# EAGLE design weather baloon_RX (EAGLE 9.2.0)
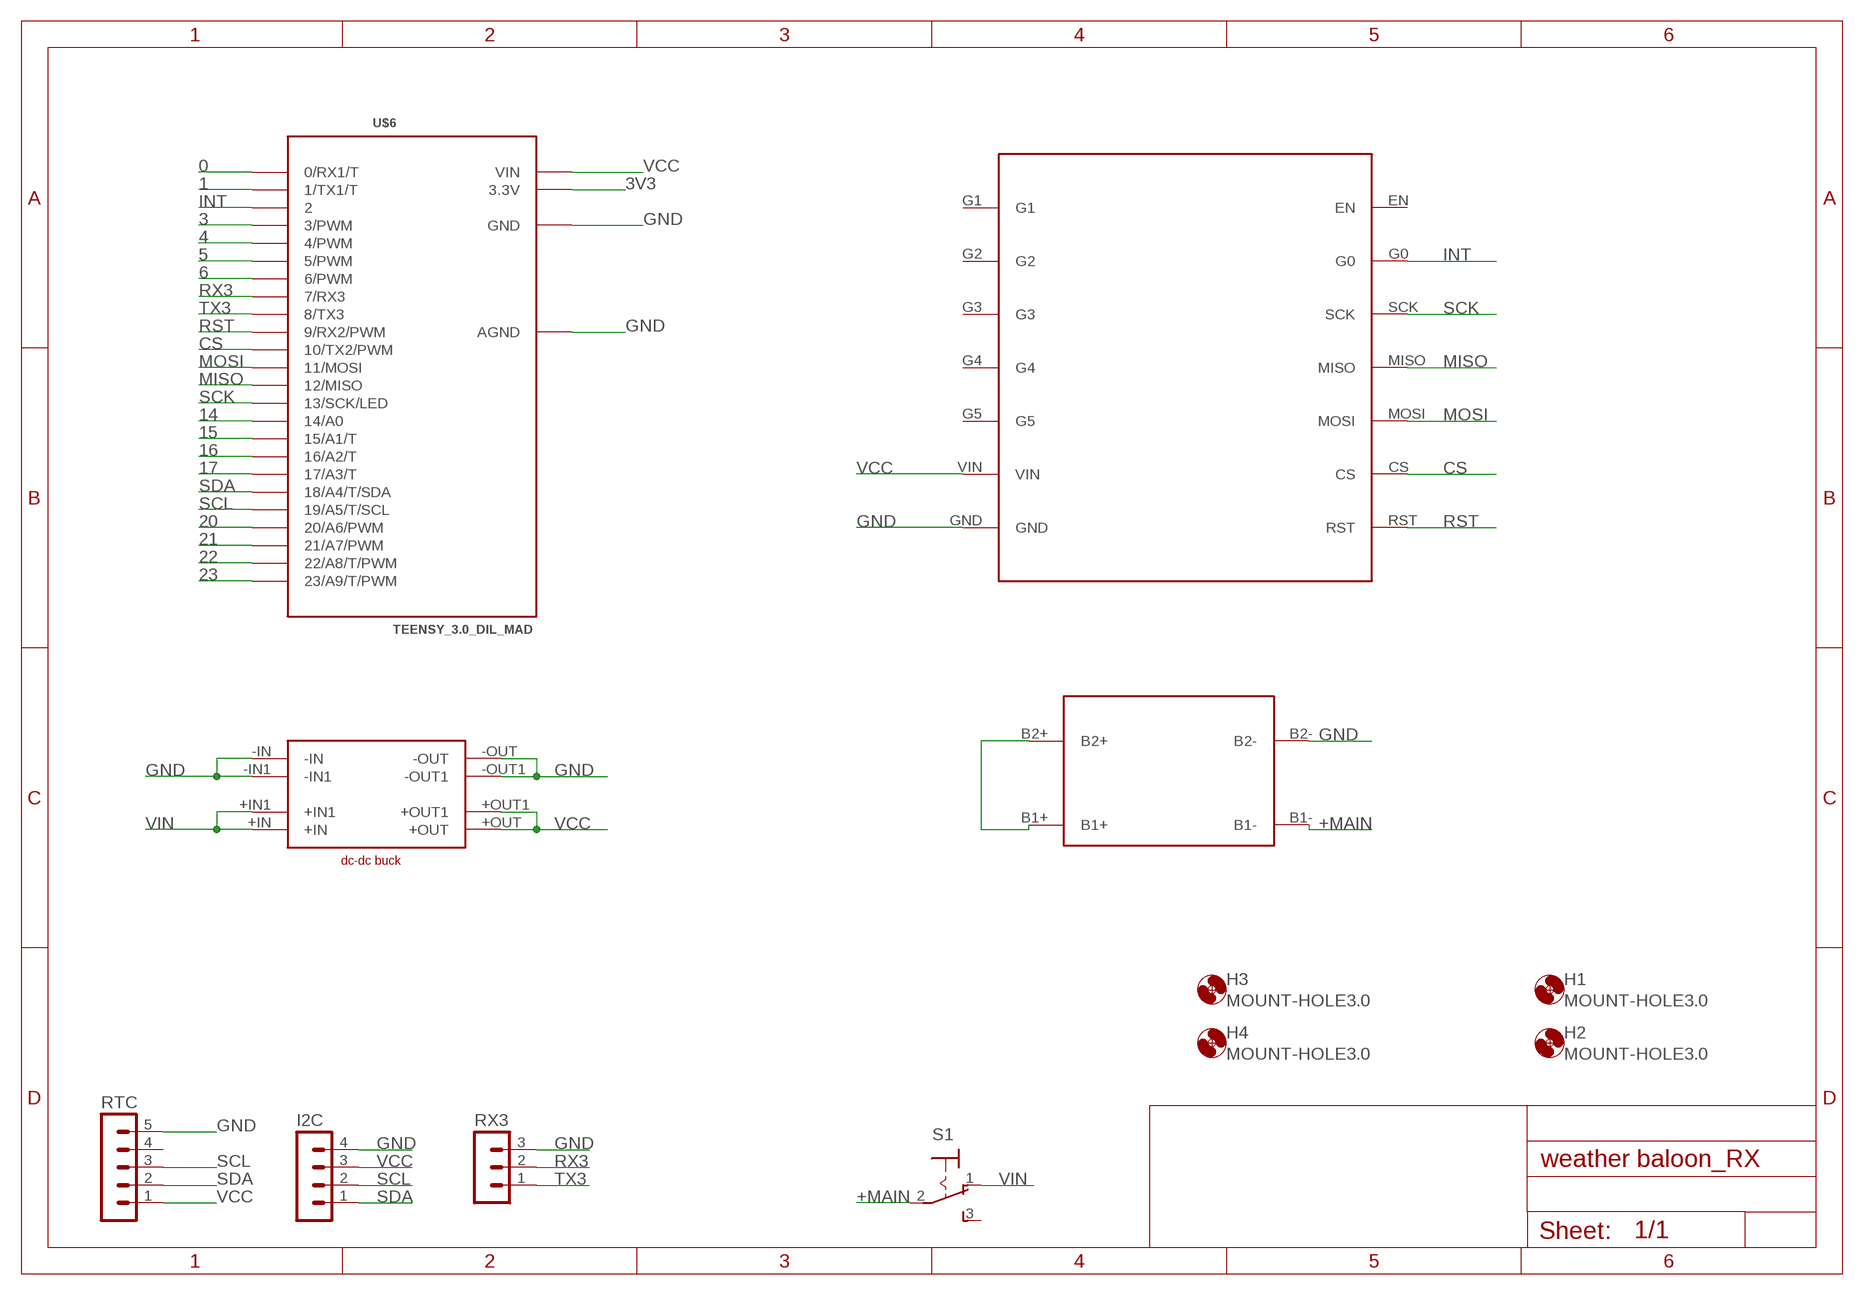
[diagram p0: schematic, sheet 1]

## Parts
H1  MOUNT-HOLE3.0  [3,0]
H2  MOUNT-HOLE3.0  [3,0]
H3  MOUNT-HOLE3.0  [3,0]
H4  MOUNT-HOLE3.0  [3,0]
I2C  MA04-1  [MA04-1]
RTC  MA05-1  [MA05-1]
RX3  MA03-1  [MA03-1]
S1  320-916  [320-916]
U$2  RFM96_MAD  [RFM96]
U$3  DC-DC_BUCK_MAD  [DC-DC_BUCK]
U$4  18650-2  [18650-2]
U$6  TEENSY_3.0_DIL_MAD  [TEENSY_3.0_DIL_MAD]

## Nets
0: U$6.0(0/RX1/T)
1: U$6.1(1/TX1/T)
3: U$6.3(3/PWM)
3V3: U$6.3.3V
4: U$6.4(4/PWM)
5: U$6.5(5/PWM)
6: U$6.6(6/PWM)
14: U$6.14/A0
15: U$6.15/A1(15/A1/T)
16: U$6.16/A2(16/A2/T)
17: U$6.17/A3(17/A3/T)
20: U$6.20/A6(20/A6/PWM)
21: U$6.21/A7(21/A7/PWM)
22: U$6.22/A8(22/A8/T/PWM)
23: U$6.23/A9(23/A9/T/PWM)
+MAIN: S1.2(P) U$4.B1-
CS: U$2.CS U$6.10(10/TX2/PWM)
GND: I2C.4 RTC.5 RX3.3 U$2.GND U$3.-IN U$3.-IN1 U$3.-OUT U$3.-OUT1 U$4.B2- U$6.AGND U$6.GND
INT: U$2.G0 U$6.2
MISO: U$2.MISO U$6.12(12/MISO)
MOSI: U$2.MOSI U$6.11(11/MOSI)
N$1: U$4.B1+ U$4.B2+
RST: U$2.RST U$6.9(9/RX2/PWM)
RX3: RX3.2 U$6.7(7/RX3)
SCK: U$2.SCK U$6.13(13/SCK/LED)
SCL: I2C.2 RTC.3 U$6.19/A5(19/A5/T/SCL)
SDA: I2C.1 RTC.2 U$6.18/A4(18/A4/T/SDA)
TX3: RX3.1 U$6.8(8/TX3)
VCC: I2C.3 RTC.1 U$2.VIN U$3.+OUT U$3.+OUT1 U$6.VIN
VIN: S1.1(O) U$3.+IN U$3.+IN1
Unconnected: RTC.4 S1.3(S) U$2.EN U$2.G1 U$2.G2 U$2.G3 U$2.G4 U$2.G5

## Library data of the parts
H1-H4 = holes:MOUNT-HOLE: MOUNTING HOLE with drill center marker
I2C = con-lstb:MA04-1: PIN HEADER; OC_FARNELL: unknown; OC_NEWARK: unknown
RTC = con-lstb:MA05-1: PIN HEADER; OC_FARNELL: unknown; OC_NEWARK: unknown
RX3 = con-lstb:MA03-1: PIN HEADER; OC_FARNELL: unknown; OC_NEWARK: unknown
S1 = switch:320-916: TOGGLE SWITCH distributor RS Components
U$2 = rfm95_mad:RFM96_MAD: rfm96_mad
U$3 = dc-dc_mad:DC-DC_BUCK_MAD
U$4 = 18650 holder-3:18650-2
U$6 = Teensy_3_and_LC_Series_Boards_v1.4:TEENSY_3.0_DIL_MAD

## Board
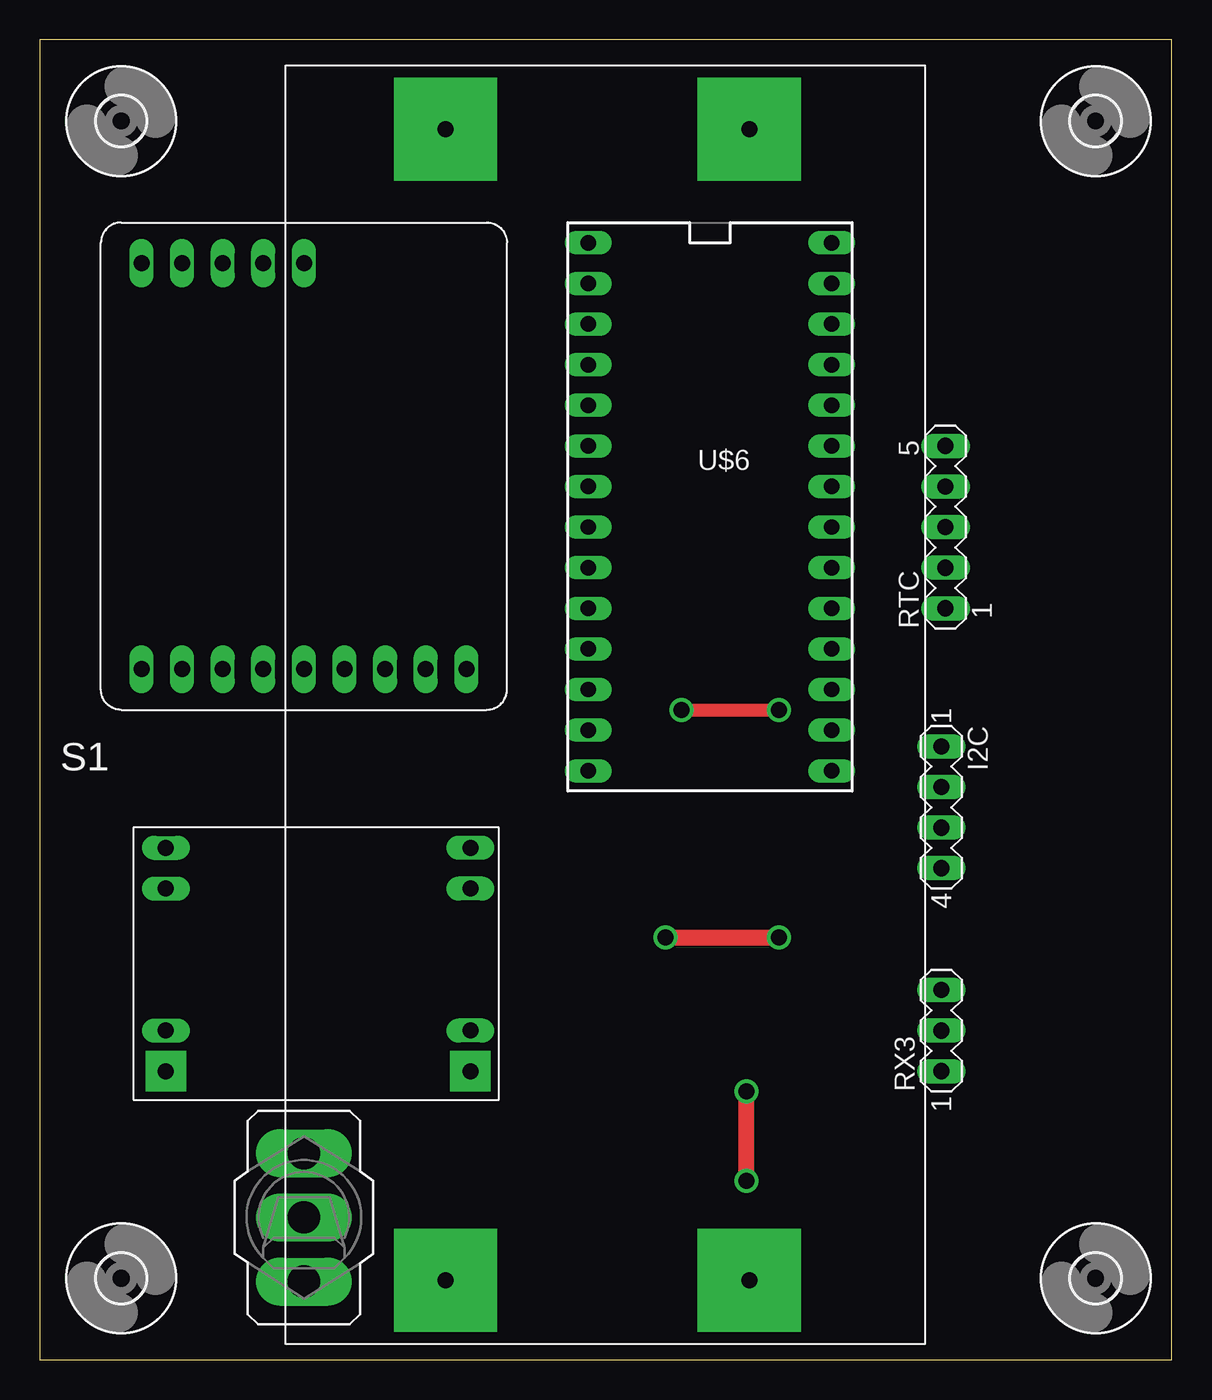
[diagram p1: board, top side]
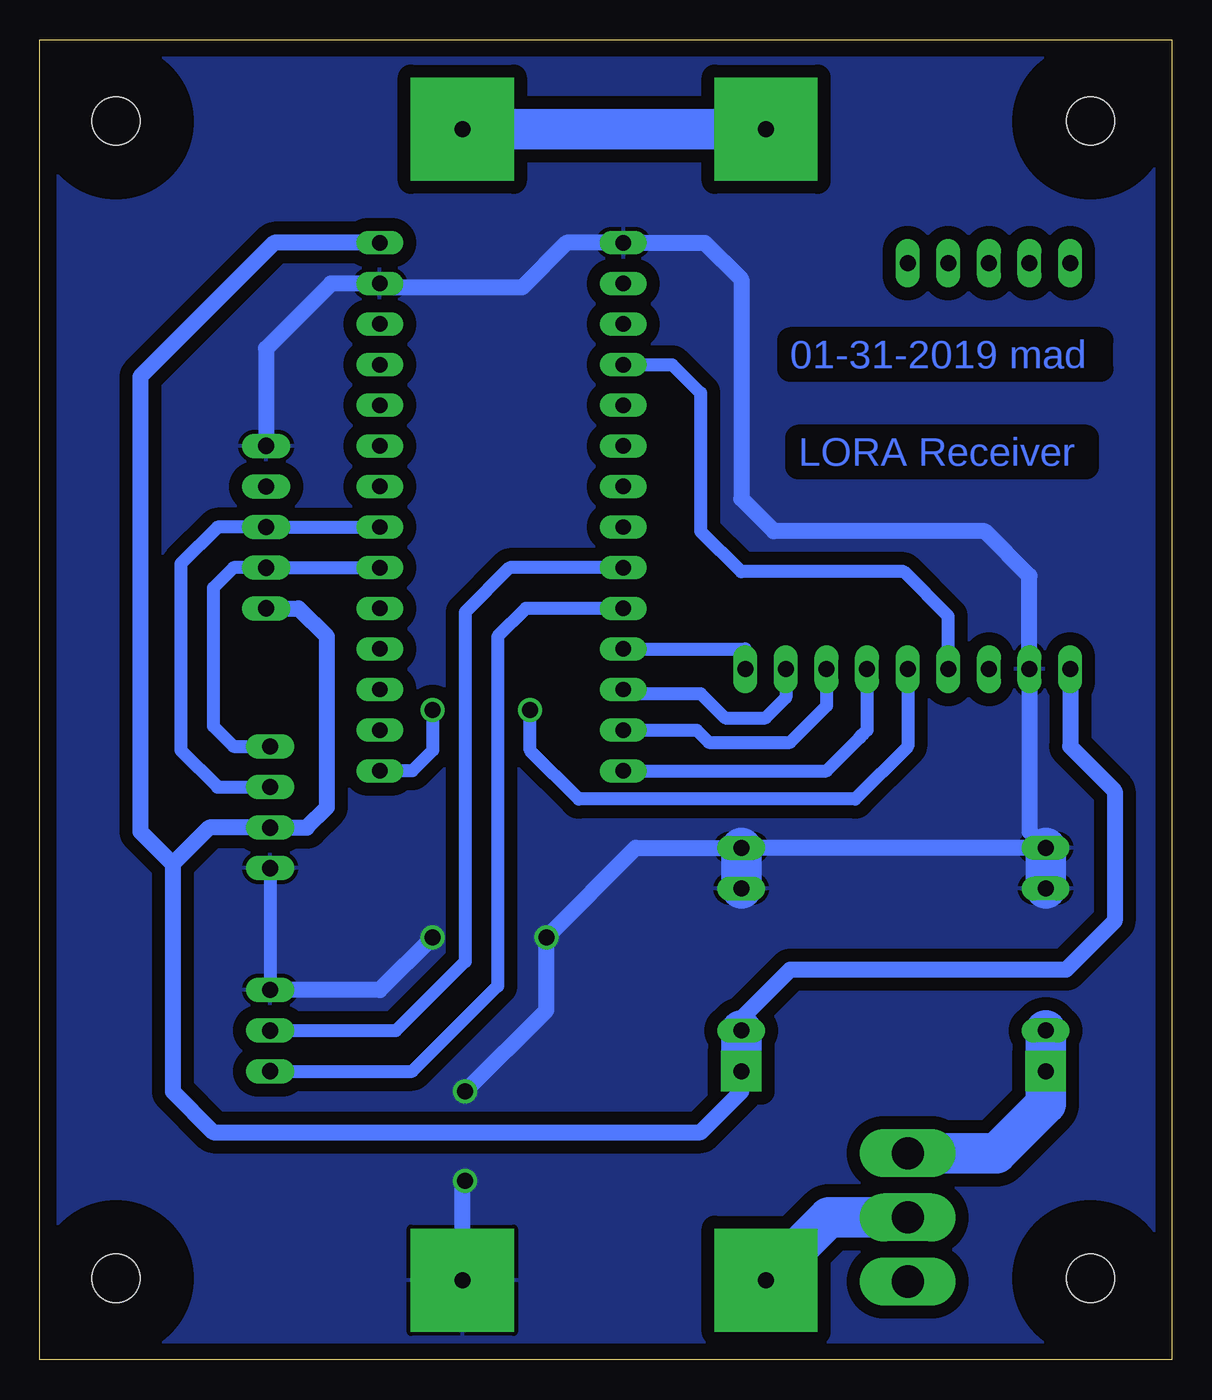
[diagram p2: board, bottom side, seen from below]

Size 70.79 x 82.54 mm. Coordinates in mm from the lower left corner, seen from the top.
Outline: 0,0 70.79,0 70.79,82.54 0,82.54 0,0
Copper layers (1*16): Top 0.035mm / dielectric 1.5mm / Bottom 0.035mm
Design rules "default": minimum track width 6mil, minimum drill 0.35mm, track to track 6mil, track to pad 6mil, pad to pad 6mil, via to via 6mil, smd to smd 6mil, copper to edge 40mil, drill to drill 6mil, minimum pad ring 10mil, minimum via ring 8mil, stop-mask expansion 4mil, vias tented up to drill 0mil, thermal gap 10mil

### Footprints (pad centres in the part's own frame; a part is rotated, then mirrored left to right if it is on the bottom)
3,0 = hole 3: 0,0
MA04-1 = drill 1.016 long: 1 -3.81,0; 2 -1.27,0; 3 1.27,0; 4 3.81,0
MA05-1 = drill 1.016 long: 1 -5.08,0; 2 -2.54,0; 3 0,0; 4 2.54,0; 5 5.08,0
MA03-1 = drill 1.016 long: 1 -2.54,0; 2 0,0; 3 2.54,0
320-916 = drill 2.007 long: 1 0,4.013; 2 0,0; 3 0,-4.013
RFM96 = drill 1 pad 1.422 long: CS 7.62,-12.7; EN -5.08,-12.7; G0 -2.54,-12.7; G1 -10.16,12.7; G2 -7.62,12.7; G3 -5.08,12.7; G4 -2.54,12.7; G5 0,12.7; GND -7.62,-12.7; MISO 2.54,-12.7; MOSI 5.08,-12.7; RST 10.16,-12.7; SCK 0,-12.7; VIN -10.16,-12.7
DC-DC_BUCK = drill 1 pad 2.54 square: +IN 7.112,-8.89; +OUT 7.112,10.16 | drill 1 long: +IN1 4.572,-8.89; +OUT1 4.572,10.16; -IN -6.858,-8.89; -IN1 -4.318,-8.89; -OUT -6.858,10.16; -OUT1 -4.318,10.16
18650-2 = drill 1 pad 6.452 square: B1+ -11.46,35.05; B1- -11.46,-36.95; B2+ 7.54,35.05; B2- 7.54,-36.95
TEENSY_3.0_DIL_MAD = drill 0.965 long: 0 -7.62,13.97; 1 -7.62,11.43; 2 -7.62,8.89; 3 -7.62,6.35; 3.3V 7.62,11.43; 4 -7.62,3.81; 5 -7.62,1.27; 6 -7.62,-1.27; 7 -7.62,-3.81; 8 -7.62,-6.35; 9 -7.62,-8.89; 10 -7.62,-11.43; 11 -7.62,-13.97; 12 -7.62,-16.51; 13 7.62,-16.51; 14/A0 7.62,-13.97; 15/A1 7.62,-11.43; 16/A2 7.62,-8.89; 17/A3 7.62,-6.35; 18/A4 7.62,-3.81; 19/A5 7.62,-1.27; 20/A6 7.62,1.27; 21/A7 7.62,3.81; 22/A8 7.62,6.35; 23/A9 7.62,8.89; AGND 7.62,13.97; GND -7.62,16.51; VIN 7.62,16.51

### Placement (x,y rotation side)
H1  5.08,77.47 0 top
H2  66.04,5.08 0 top
H3  66.04,77.47 0 top
H4  5.08,5.08 0 top
I2C  56.39,34.54 270 top
RTC  56.64,52.07 90 top
RX3  56.39,20.57 90 top
S1  16.51,8.89 0 top
U$2  16.51,55.88 0 top
U$3  16.76,25.15 270 top
U$4  36.83,41.91 0 top
U$6  41.91,53.34 0 top

### Tracks (layer width: path | path; a pad name or v marks a point on that pad's centre or on a via)
+MAIN
  Bottom 2.54: S1.2 21.44,8.89 U$4.B1-
CS
  Bottom 0.813: U$2.CS 24.13,41.4 25.4,40.13 27.94,40.13 29.46,41.66 34.04,41.66 U$6.10
GND  (via drill 1 pad 0.85)
  Top 1.016: v44.2,11.18 v44.2,16.76 | v39.12,26.42 v46.23,26.42
  Bottom 0.813: I2C.4 RX3.3
  Bottom 1.016: U$4.B2- 44.37,11 v44.2,11.18 | v44.2,16.76 39.12,21.84 v39.12,26.42 33.53,32 U$3.-OUT U$3.-IN 8.89,33.02 U$2.GND 8.89,49.02 11.68,51.82 24.89,51.82 26.92,53.85 26.92,67.56 29.21,69.85 U$6.GND 37.85,69.85 40.64,67.06 49.28,67.06 U$6.AGND 52.58,67.31 56.64,63.25 RTC.5 | v46.23,26.42 49.53,23.11 RX3.3
  Bottom 2.54: U$3.-OUT U$3.-OUT1 | U$3.-IN U$3.-IN1
  pour Bottom (isolate 0.813): 1.02,81.79 70.1,81.79 70.1,0.51 0.51,0.51 0.51,81.79
INT
  Bottom 0.813: U$2.G0 13.97,46.48 16.76,49.28 26.92,49.28 29.46,51.82 29.46,60.45 31.24,62.23 U$6.2
MISO
  Bottom 0.813: U$6.12 21.59,36.83 19.56,38.86 19.3,39.12 19.05,39.37 U$2.MISO
MOSI
  Bottom 0.813: U$6.11 29.72,39.37 28.96,38.61 23.88,38.61 21.59,40.89 U$2.MOSI
N$1
  Bottom 2.54: U$4.B1+ U$4.B2+
RST
  Bottom 0.813: U$6.9 26.67,44.45 U$2.RST
RX3
  Bottom 0.813: U$6.7 41.4,49.53 44.2,46.74 44.2,24.89 48.51,20.57 RX3.2
SCK  (via drill 1 pad 0.85)
  Top 0.813: v40.13,40.64 v46.23,40.64
  Bottom 0.813: U$2.SCK 16.51,38.35 19.81,35.05 37.08,35.05 40.13,38.1 v40.13,40.64 | v46.23,40.64 46.23,38.1 47.5,36.83 U$6.13
SCL
  Bottom 0.813: U$6.19/A5 RTC.3 59.69,52.07 61.98,49.78 61.98,38.1 59.69,35.81 I2C.2
SDA
  Bottom 0.813: U$6.18/A4 RTC.2 58.67,49.53 59.94,48.26 59.94,39.62 58.67,38.35 I2C.1
TX3
  Bottom 0.813: RX3.1 47.5,18.03 42.16,23.37 42.16,45.21 40.39,46.99 U$6.8
VCC
  Bottom 1.016: RTC.1 54.61,46.99 52.83,45.21 52.83,34.54 54.1,33.27 I2C.3 60.2,33.27 62.48,30.99 | 62.48,30.99 62.48,16.76 59.94,14.22 29.46,14.22 26.92,16.76 U$3.+OUT | U$2.VIN 6.35,38.35 3.56,35.56 3.56,27.43 6.6,24.38 23.88,24.38 26.92,21.34 U$3.+OUT1 | U$6.VIN 56.13,69.85 64.52,61.47 64.52,33.02 62.48,30.99
  Bottom 2.54: U$3.+OUT1 U$3.+OUT
VIN
  Bottom 2.54: S1.1 10.97,12.9 7.87,16 U$3.+IN U$3.+IN1

### Text on the board
Bottom: 01-31-2019 mad | LORA Receiver